# EAGLE design PID (EAGLE 9.5.2)
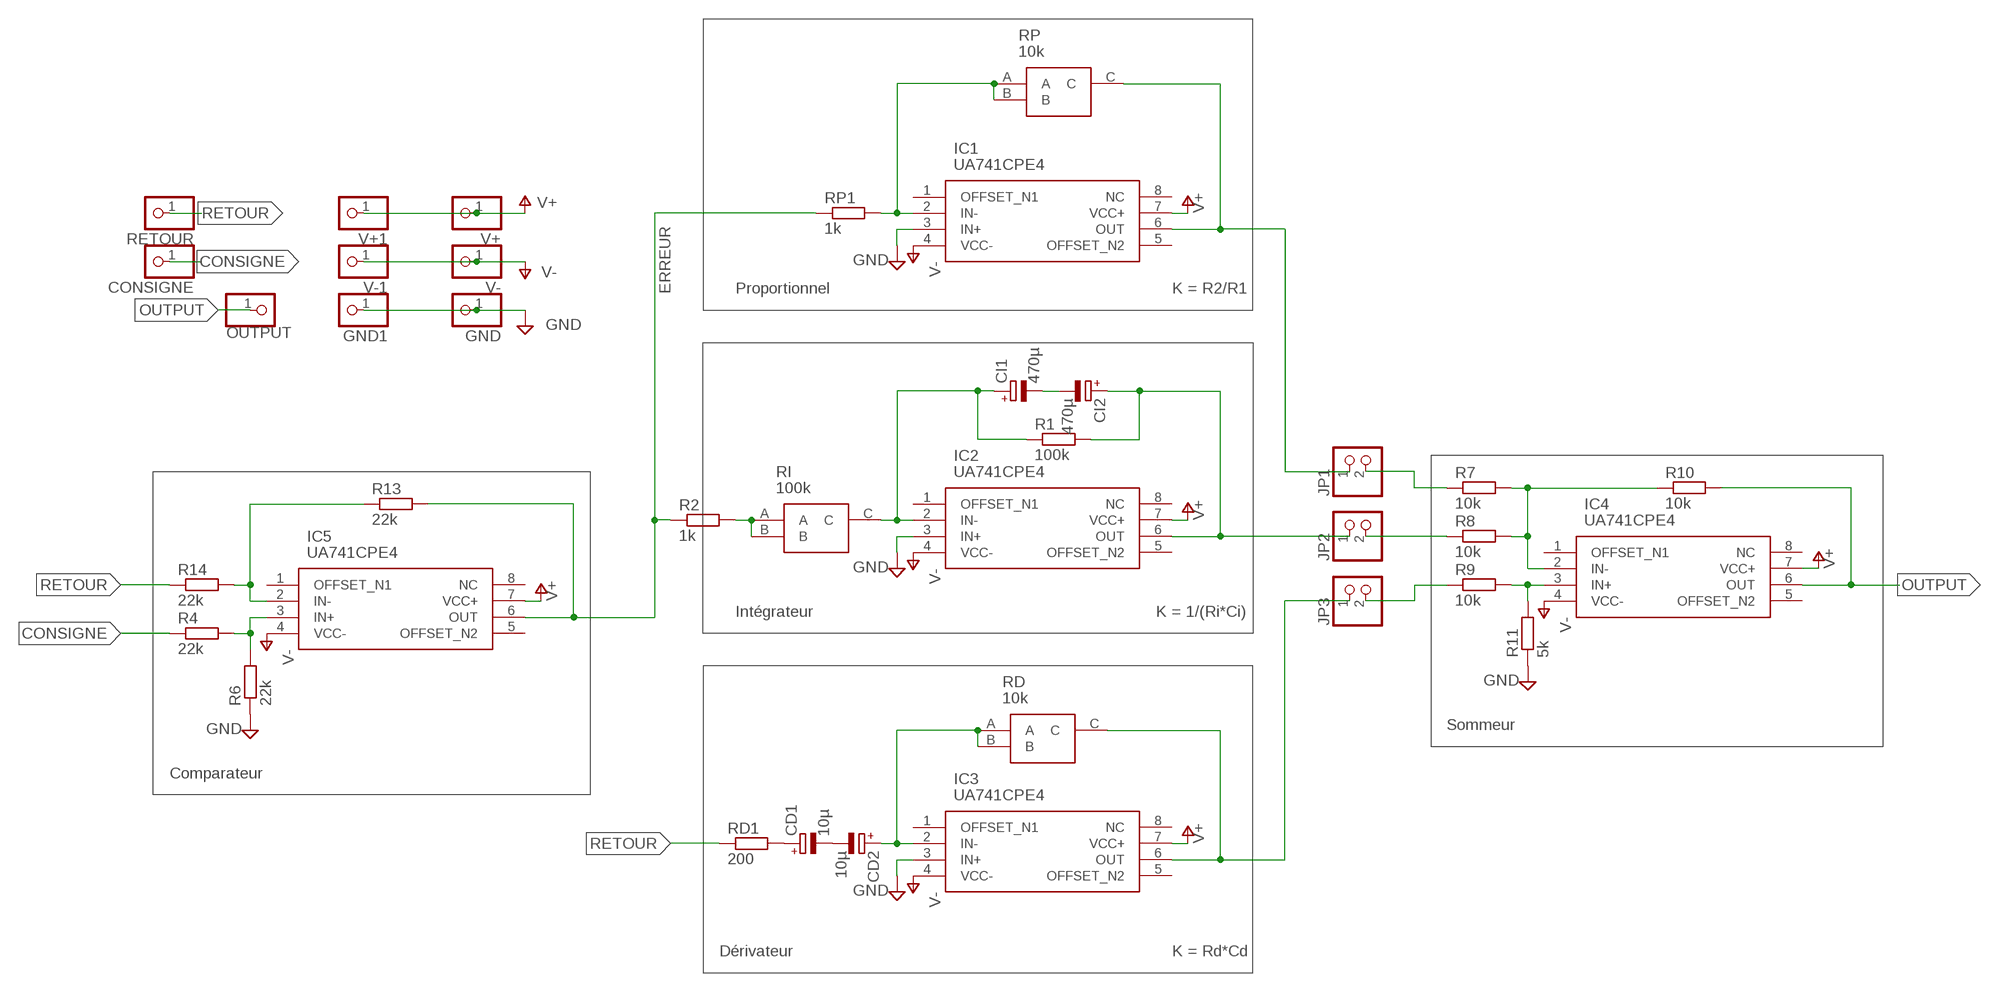
[diagram p0: schematic, sheet 1]

## Parts
CD1  10µ  CPOL-EUE2.5-6  [E2,5-6]
CD2  10µ  CPOL-EUE2.5-6  [E2,5-6]
CI1  470µ  CPOL-EUE2.5-6  [E2,5-6]
CI2  470µ  CPOL-EUE2.5-6  [E2,5-6]
CONSIGNE  PINHD-1X1  [1X01]
GND  PINHD-1X1  [1X01]
GND1  PINHD-1X1  [1X01]
IC1  UA741CPE4  [DIP794W53P254L959H508Q8N]
IC2  UA741CPE4  [DIP794W53P254L959H508Q8N]
IC3  UA741CPE4  [DIP794W53P254L959H508Q8N]
IC4  UA741CPE4  [DIP794W53P254L959H508Q8N]
IC5  UA741CPE4  [DIP794W53P254L959H508Q8N]
JP1  PINHD-1X2  [1X02]
JP2  PINHD-1X2  [1X02]
JP3  PINHD-1X2  [1X02]
OUTPUT  PINHD-1X1  [1X01]
R1  100k  R-EU_0204/7  [0204/7]
R2  1k  R-EU_0204/7  [0204/7]
R4  22k  R-EU_0204/7  [0204/7]
R6  22k  R-EU_0204/7  [0204/7]
R7  10k  R-EU_0204/7  [0204/7]
R8  10k  R-EU_0204/7  [0204/7]
R9  10k  R-EU_0204/7  [0204/7]
R10  10k  R-EU_0204/7  [0204/7]
R11  5k  R-EU_0204/7  [0204/7]
R13  22k  R-EU_0204/7  [0204/7]
R14  22k  R-EU_0204/7  [0204/7]
RD  10k  T7YA103MT20  [T7YA]
RD1  200  R-EU_0204/7  [0204/7]
RETOUR  PINHD-1X1  [1X01]
RI  100k  T7YA103MT20  [T7YA]
RP  10k  T7YA103MT20  [T7YA]
RP1  1k  R-EU_0204/7  [0204/7]
V+  PINHD-1X1  [1X01]
V+1  PINHD-1X1  [1X01]
V-  PINHD-1X1  [1X01]
V-1  PINHD-1X1  [1X01]

## Nets
CONSIGNE: CONSIGNE.1 R4.1
ERREUR: IC5.6(OUT) R2.1 R13.2 RP1.1
GND: GND1.1 GND.1 IC1.3(IN+) IC2.3(IN+) IC3.3(IN+) R6.1 R11.1
N$2: IC1.6(OUT) JP1.1 RP.C
N$3: IC1.2(IN-) RP1.2 RP.A RP.B
N$4: CI2.+ IC2.6(OUT) JP2.1 R1.2
N$5: CI1.+ IC2.2(IN-) R1.1 RI.C
N$7: IC4.2(IN-) R7.2 R8.2 R10.1
N$8: CI1.- CI2.-
N$9: IC5.2(IN-) R13.1 R14.2
N$10: IC3.6(OUT) JP3.1 RD.C
N$11: CD2.+ IC3.2(IN-) RD.A RD.B
N$12: JP1.2 R7.1
N$13: IC5.3(IN+) R4.2 R6.2
N$14: CD1.- CD2.-
N$15: R2.2 RI.A RI.B
N$16: JP2.2 R8.1
N$17: CD1.+ RD1.2
N$18: IC4.3(IN+) R9.2 R11.2
N$19: JP3.2 R9.1
OUTPUT: IC4.6(OUT) OUTPUT.1 R10.2
RETOUR: R14.1 RD1.1 RETOUR.1
V+: IC1.7(VCC+) IC2.7(VCC+) IC3.7(VCC+) IC4.7(VCC+) IC5.7(VCC+) V+1.1 V+.1
V-: IC1.4(VCC-) IC2.4(VCC-) IC3.4(VCC-) IC4.4(VCC-) IC5.4(VCC-) V-1.1 V-.1
Unconnected: IC1.1(OFFSET_N1) IC1.5(OFFSET_N2) IC1.8(NC) IC2.1(OFFSET_N1) IC2.5(OFFSET_N2) IC2.8(NC) IC3.1(OFFSET_N1) IC3.5(OFFSET_N2) IC3.8(NC) IC4.1(OFFSET_N1) IC4.5(OFFSET_N2) IC4.8(NC) IC5.1(OFFSET_N1) IC5.5(OFFSET_N2) IC5.8(NC)

## Notes on the sheet
- Proportionnel | K = R2/R1
- Intégrateur | K = 1/(Ri*Ci)
- Sommeur
- Comparateur
- Dérivateur | K = Rd*Cd

## Library data of the parts
CD1 CD2 CI1 CI2 = rcl:CPOL-EU: POLARIZED CAPACITOR, European symbol; SPICEPREFIX: C
CONSIGNE GND GND1 OUTPUT RETOUR V+ V+1 V- V-1 = pinhead:PINHD-1X1: PIN HEADER
IC1-IC5 = SamacSys_Parts:UA741CPE4: A741 General-Purpose Operational Amplifiers Source: Datasheet <http://www.ti.com/lit/ds/symlink/ua741.pdf>; DESCRIPTION: A741 General-Purpose Operational Amplifiers; HEIGHT: 5.08mm; MANUFACTURER_NAME: Texas Instruments; MANUFACTURER_PART_NUMBER: UA741CPE4; MOUSER_PART_NUMBER: 595-UA741CPE4; MOUSER_PRICE-STOCK: https://www.mouser.com/Search/Refine.aspx?Keyword=595-UA741CPE4; SPICEMODEL: OPAMP; SPICEPREFIX: X
JP1-JP3 = pinhead:PINHD-1X2: PIN HEADER
R1 R2 R4 R6-R11 R13 R14 RD1 RP1 = rcl:R-EU_: RESISTOR, European symbol; SPICEPREFIX: R
RD RI RP = PFE:T7YA103MT20: Vishay T7YA Series Through Hole Trimmer Resistor with Pin Terminations, 10k +/-10% 1/2W +/-100ppm/C Top Adjust Source: Datasheet <https://docs-emea.rs-online.com/webdocs/0021/0900766b8002111f.pdf>; DESCRIPTION: Vishay T7YA Series Through Hole Trimmer Resistor with Pin Terminations, 10k +/-10% 1/2W +/-100ppm/C Top Adjust; HEIGHT: mm; MANUFACTURER_NAME: Vishay; MANUFACTURER_PART_NUMBER: T7YA103MT20; MOUSER_PART_NUMBER: N/A; MOUSER_PRICE-STOCK: https://www.mouser.com/Search/Refine.aspx?Keyword=N%2FA; RS_PART_NUMBER: 3746787P; RS_PRICE-STOCK: http://uk.rs-online.com/web/p/products/3746787P

## Net classes
0 default: width 1.27 mm

## Board
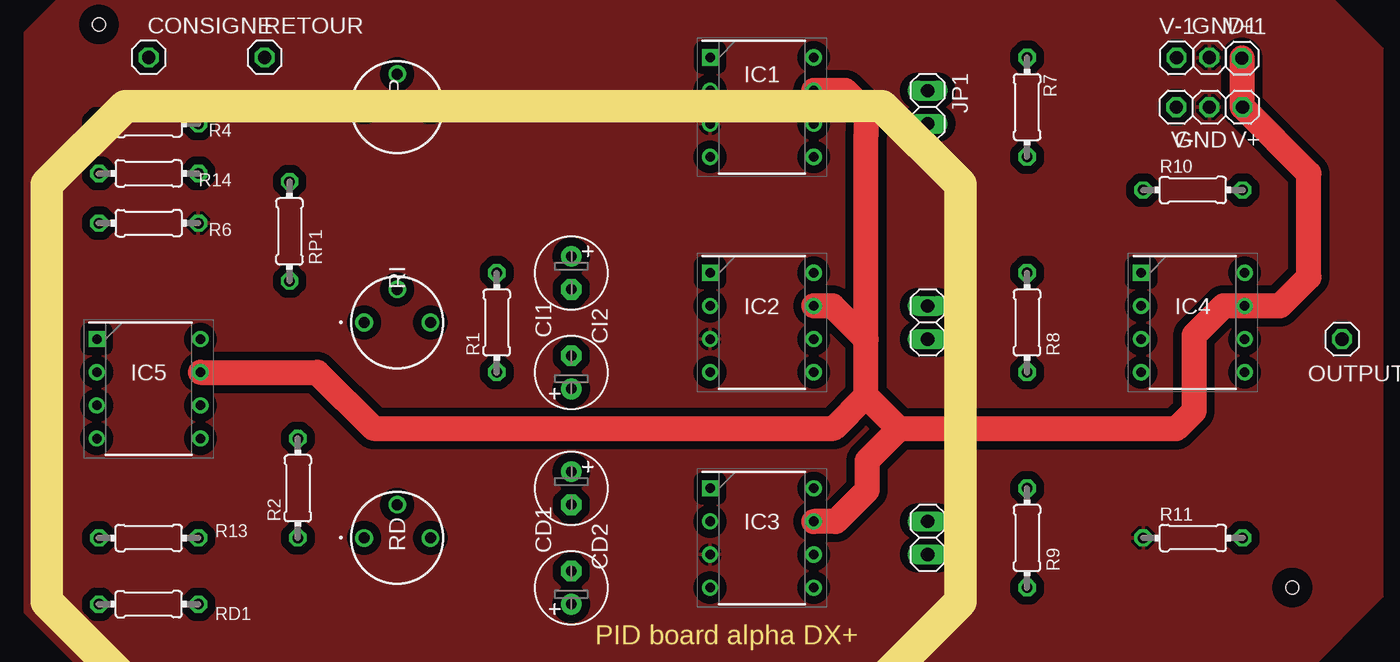
[diagram p1: board, top side]
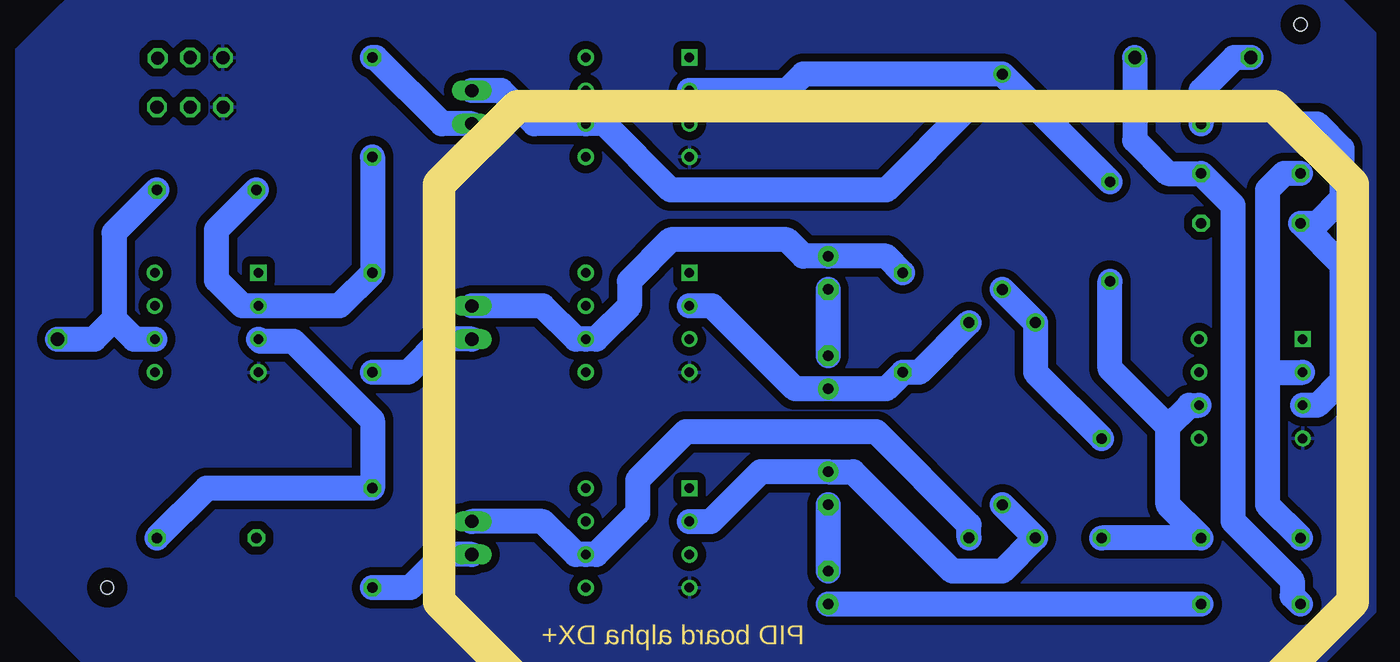
[diagram p2: board, bottom side, seen from below]

No outline drawn. Coordinates in mm, seen from the top.
Copper layers (1*16): Top 0.035mm / dielectric 1.5mm / Bottom 0.035mm
Design rules "default *": minimum track width 6mil, minimum drill 0.35mm, track to track 25mil, track to pad 25mil, pad to pad 25mil, via to via 25mil, smd to smd 25mil, copper to edge 40mil, drill to drill 6mil, minimum pad ring 10mil, minimum via ring 8mil, stop-mask expansion 4mil, vias tented up to drill 0mil, thermal gap 10mil
Holes 1 mm at 0,48.26 91.44,5.08
Milling: 8 lines

### Footprints (pad centres in the part's own frame; a part is rotated, then mirrored left to right if it is on the bottom)
E2,5-6 = drill 0.813 pad 1.6: + -1.27,0 | drill 0.813 pad 1.6 octagon: - 1.27,0
1X01 = drill 1.016 octagon: 1 0,0
DIP794W53P254L959H508Q8N = drill 0.73 pad 1.13 square: 1 -3.97,3.81 | drill 0.73 pad 1.13: 2 -3.97,1.27; 3 -3.97,-1.27; 4 -3.97,-3.81; 5 3.97,-3.81; 6 3.97,-1.27; 7 3.97,1.27; 8 3.97,3.81
1X02 = drill 1.016 long: 1 -1.27,0; 2 1.27,0
0204/7 = drill 0.813 octagon: 1 -3.81,0; 2 3.81,0
T7YA = drill 0.84 pad 1.3: A 0,-2.54; B -2.54,0; C 0,2.54

### Placement (x,y rotation side)
CD1  36.2,5.08 90 top
CD2  36.2,12.7 270 top
CI1  36.2,21.59 90 top
CI2  36.2,29.21 270 top
CONSIGNE  3.81,45.72 270 top
GND  85.09,41.91 180 top
GND1  85.09,45.72 0 top
IC1  50.8,41.91 0 top
IC2  50.8,25.4 0 top
IC3  50.8,8.89 0 top
IC4  83.82,25.4 0 top
IC5  3.81,20.32 0 top
JP1  63.5,41.91 270 top
JP2  63.5,25.4 270 top
JP3  63.5,8.89 270 top
OUTPUT  95.25,24.13 0 top
R1  30.48,25.4 90 top
R2  15.24,12.7 90 top
R4  3.81,40.64 180 top
R6  3.81,33.02 180 top
R7  71.12,41.91 270 top
R8  71.12,25.4 90 top
R9  71.12,8.89 90 top
R10  83.82,35.56 0 top
R11  83.82,8.89 0 top
R13  3.81,8.89 0 top
R14  3.81,36.83 180 top
RD  22.86,8.89 270 top
RD1  3.81,3.81 0 top
RETOUR  12.7,45.72 270 top
RI  22.86,25.4 270 top
RP  22.86,41.91 270 top
RP1  14.61,32.38 90 top
V+  87.63,41.91 180 top
V+1  87.58,45.67 0 top
V-  82.55,41.91 180 top
V-1  82.58,45.69 0 top

### Tracks (layer width: path | path; a pad name or v marks a point on that pad's centre or on a via)
CONSIGNE
  Bottom 1.905: CONSIGNE.1 5.08,45.72 7.62,43.18 R4.1
ERREUR
  Bottom 1.905: 10.16,17.43 10.16,11.43 R13.2 R2.1 | 10.16,17.43 14.61,21.88 RP1.1 | 10.16,17.43 8.54,19.05 IC5.6
GND
  pour Top: 98.38,4.4 98.38,46.4 91.39,53.39 0.05,53.39 -5.71,47.62 -5.71,3.17 -0.64,-1.91 92.08,-1.91
N$2
  Bottom 1.905: RP.C 31.75,35.56 48.26,35.56 53.34,40.64 IC1.6 58.71,40.64 61.25,43.18 JP1.1
N$3
  Bottom 1.905: RP1.2 RP.A RP.B 38.1,44.45 39.37,43.18 IC1.2
N$4
  Bottom 1.905: R1.2 31.75,30.48 CI2.+ 38.1,30.48 39.37,31.75 48.26,31.75 51.44,28.57 51.44,26.67 53.98,24.13 IC2.6 55.53,24.13 58.07,26.67 JP2.1
N$5
  Bottom 1.905: RI.C 29.21,21.59 R1.1 31.75,20.32 CI1.+ 38.73,20.32 45.09,26.67 IC2.2
N$7
  Bottom 1.905: R7.2 R8.2 73.66,26.67 IC4.2 81.08,26.67 83.06,28.65 83.06,32.51 R10.1
N$8
  Bottom 1.905: CI2.- CI1.-
N$9
  Bottom 1.905: R14.2 1.27,36.83 2.54,35.56 2.54,21.59 | 2.54,21.59 IC5.2 | R13.1 2.54,11.43 2.54,21.59
N$10
  Bottom 1.905: RD.C 25.4,9.91 32.51,17.02 47.12,17.02 50.8,13.34 50.8,10.79 53.98,7.62 IC3.6 55.53,7.62 58.07,10.16 JP3.1
N$11
  Bottom 1.905: RD.B RD.A 22.86,6.35 26.67,6.35 34.29,13.97 CD2.+ 41.37,13.97 45.18,10.16 IC3.2
N$12
  Bottom 1.905: JP1.2 65.79,40.64 70.87,45.72 R7.1
N$13
  Bottom 1.905: R4.2 -1.27,40.64 -3.17,38.73 -3.17,34.92 -1.27,33.02 R6.2 -3.17,29.84 -3.17,20.95 -1.27,19.05 IC5.3
N$14
  Bottom 1.905: CD2.- CD1.-
N$15
  Bottom 1.905: R2.2 20.32,21.59 RI.A RI.B
N$16
  Bottom 1.905: JP2.2 65.86,24.13 68.4,21.59 R8.1
N$17
  Bottom 1.905: RD1.2 CD1.+
N$18
  Bottom 1.905: IC4.3 79.7,23.98 77.19,23.98 71.12,17.91 R9.2 83.82,12.7 R11.2
N$19
  Bottom 1.905: JP3.2 65.68,7.62 68.22,5.08 R9.1
OUTPUT
  Bottom 1.905: R10.2 90.91,32.28 90.91,25.65 | 90.91,25.65 89.38,24.13 IC4.6 | OUTPUT.1 92.43,24.13 90.91,25.65
RETOUR
  Bottom 1.905: RETOUR.1 12.7,39.37 10.16,36.83 R14.1 5.18,34.39 5.18,10.19 0.64,5.64 0.64,4.45 RD1.1
V+
  Top 1.905: 61.29,17.25 82.55,17.25 83.9,18.59 83.9,24.41 86.16,26.67 IC4.7 90.5,26.67 92.71,28.88 92.71,36.83 V+.1 87.58,41.96 V+1.1 | 61.29,17.25 58.85,14.81 58.85,12.55 56.46,10.16 IC3.7 | 61.29,17.25 58.78,19.76 | 58.78,19.76 58.78,24.11 | 58.78,24.11 56.21,26.67 IC2.7 | 58.78,24.11 58.78,39.83 58.8,39.85 58.8,41.58 57.2,43.18 IC1.7 | IC5.7 16.74,21.59 21.03,17.3 56.31,17.3 58.78,19.76
V-
  pour Bottom: 98.42,4.45 98.42,46.35 91.44,53.34 0,53.34 -5.71,47.62 -5.71,3.17 -0.64,-1.91 92.08,-1.91

### Text on the board
Milling: PID board alpha DX+